# EAGLE schematic darklamp (EAGLE 6.6.0)
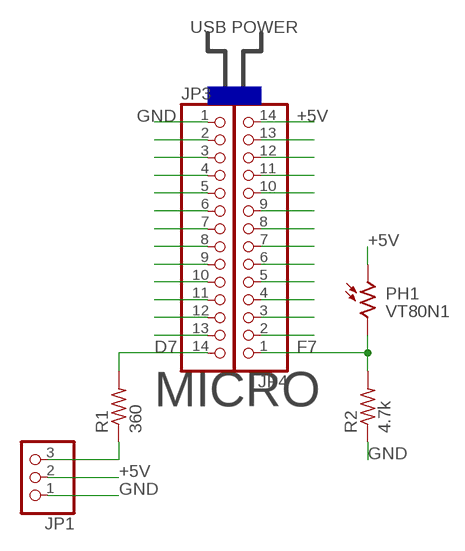
[diagram p0: schematic, sheet 1]

## Parts
JP1  PINHD-1X3  [1X03]
JP3  PINHD-1X14  [1X14]
JP4  PINHD-1X14  [1X14]
PH1  VT80N1  [VT800]
R1  360  R-US_0204/2V  [0204V]
R2  4.7k  R-US_0204/2V  [0204V]

## Nets
+5V: JP1.2 JP4.14 PH1.1
B0: JP3.2
B1: JP3.3
B2: JP3.4
B3: JP3.5
D0: JP3.7
D1: JP3.8
D2: JP3.9
D7: JP3.14 R1.2
F7: JP4.1 PH1.2 R2.2
GND: JP1.1 JP3.1 R2.1
N$1: JP1.3 R1.1
N$10: JP3.6
N$20: JP3.10
N$21: JP3.11
N$22: JP3.12
N$23: JP3.13
N$26: JP4.13
N$27: JP4.12
N$28: JP4.11
N$29: JP4.10
N$30: JP4.9
N$31: JP4.8
N$32: JP4.7
N$33: JP4.6
N$34: JP4.5
N$35: JP4.4
N$36: JP4.3
N$37: JP4.2

## Notes on the sheet
- USB POWER
- MICRO

## Library data of the parts
JP1 = pinhead:PINHD-1X3: PIN HEADER
JP3 JP4 = pinhead:PINHD-1X14: PIN HEADER
PH1 = photo-elements:VT8: Photoconductive Cell VT800 Series Source: http://optoelectronics.perkinelmer.com/content/Datasheets/DTS_vt800seriesdatasheet.pdf
R1 R2 = rcl:R-US_: RESISTOR, American symbol